# Altium schematic sheet J1.schdoc: TEBF0808 - B2B-connector J1
size A4; DocumentNumber: TEBF0808; Revision: 04; SheetNumber: 3; SheetTotal: 36; Date: 2016-09-29; CompanyName: Trenz Electronic GmbH; Organization: Trenz Electronic GmbH
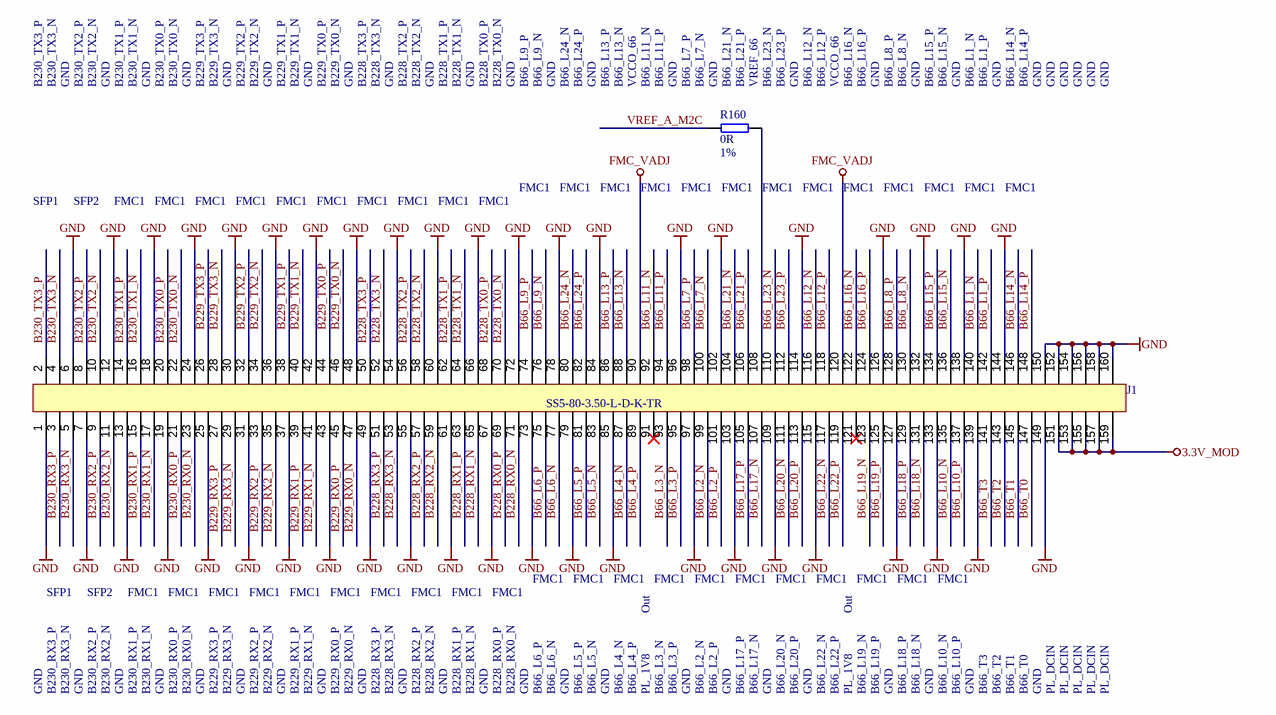
[diagram p0: J1.schdoc]

## Parts
J1  SS5-80-3.50-L-D-K-TR  [SS5-80-3.50-L-D-K-TR]
R160  0R  Tolerance: 1%  [RESC1005X40N]

## Nets
3.3V_MOD: J1.151 J1.153 J1.155 J1.157 J1.159
FMC_VADJ: J1.90 J1.120
GND: J1.1 J1.6 J1.7 J1.12 J1.13 J1.18 J1.19 J1.24 J1.25 J1.30 J1.31 J1.36 J1.37 J1.42 J1.43 J1.48 J1.49 J1.54 J1.55 J1.60 J1.61 J1.66 J1.67 J1.72 J1.73 J1.78 J1.79 J1.84 J1.85 J1.96 J1.97 J1.102 J1.103 J1.109 J1.114 J1.115 J1.126 J1.127 J1.132 J1.133 J1.138 J1.139 J1.144 J1.149 J1.150 J1.152 J1.154 J1.156 J1.158 J1.160
B66_L1_N: J1.140
B66_L1_P: J1.142
B66_L2_N: J1.99
B66_L2_P: J1.101
B66_L3_N: J1.93
B66_L3_P: J1.95
B66_L4_N: J1.87
B66_L4_P: J1.89
B66_L5_N: J1.83
B66_L5_P: J1.81
B66_L6_N: J1.77
B66_L6_P: J1.75
B66_L7_N: J1.100
B66_L7_P: J1.98
B66_L8_N: J1.130
B66_L8_P: J1.128
B66_L9_N: J1.76
B66_L9_P: J1.74
B66_L10_N: J1.135
B66_L10_P: J1.137
B66_L11_N: J1.92
B66_L11_P: J1.94
B66_L12_N: J1.116
B66_L12_P: J1.118
B66_L13_N: J1.88
B66_L13_P: J1.86
B66_L14_N: J1.146
B66_L14_P: J1.148
B66_L15_N: J1.136
B66_L15_P: J1.134
B66_L16_N: J1.122
B66_L16_P: J1.124
B66_L17_N: J1.107
B66_L17_P: J1.105
B66_L18_N: J1.131
B66_L18_P: J1.129
B66_L19_N: J1.123
B66_L19_P: J1.125
B66_L20_N: J1.111
B66_L20_P: J1.113
B66_L21_N: J1.104
B66_L21_P: J1.106
B66_L22_N: J1.117
B66_L22_P: J1.119
B66_L23_N: J1.110
B66_L23_P: J1.112
B66_L24_N: J1.80
B66_L24_P: J1.82
B66_T0: J1.147
B66_T1: J1.145
B66_T2: J1.143
B66_T3: J1.141
B228_RX0_N: J1.71
B228_RX0_P: J1.69
B228_RX1_N: J1.65
B228_RX1_P: J1.63
B228_RX2_N: J1.59
B228_RX2_P: J1.57
B228_RX3_N: J1.53
B228_RX3_P: J1.51
B228_TX0_N: J1.70
B228_TX0_P: J1.68
B228_TX1_N: J1.64
B228_TX1_P: J1.62
B228_TX2_N: J1.58
B228_TX2_P: J1.56
B228_TX3_N: J1.52
B228_TX3_P: J1.50
B229_RX0_N: J1.47
B229_RX0_P: J1.45
B229_RX1_N: J1.41
B229_RX1_P: J1.39
B229_RX2_N: J1.35
B229_RX2_P: J1.33
B229_RX3_N: J1.29
B229_RX3_P: J1.27
B229_TX0_N: J1.46
B229_TX0_P: J1.44
B229_TX1_N: J1.40
B229_TX1_P: J1.38
B229_TX2_N: J1.34
B229_TX2_P: J1.32
B229_TX3_N: J1.28
B229_TX3_P: J1.26
B230_RX0_N: J1.23
B230_RX0_P: J1.21
B230_RX1_N: J1.17
B230_RX1_P: J1.15
B230_RX2_N: J1.11
B230_RX2_P: J1.9
B230_RX3_N: J1.5
B230_RX3_P: J1.3
B230_TX0_N: J1.22
B230_TX0_P: J1.20
B230_TX1_N: J1.16
B230_TX1_P: J1.14
B230_TX2_N: J1.10
B230_TX2_P: J1.8
B230_TX3_N: J1.4
B230_TX3_P: J1.2
VREF_A_M2C: R160.2
NetJ1_108: J1.108 R160.1

Not connected (* = marked no-connect by the designer): J1 91* 121*

## Notes on the sheet
- B230_TX3_P
- B230_TX3_N
- GND
- B230_TX2_P
- B230_TX2_N
- B230_TX1_P
- B230_TX1_N
- B230_TX0_P
- B230_TX0_N
- B229_TX3_P
- B229_TX3_N
- B229_TX2_P
- B229_TX2_N
- B229_TX1_P
- B229_TX1_N
- B229_TX0_P
- B229_TX0_N
- B228_TX3_P
- B228_TX3_N
- B228_TX2_P
- B228_TX2_N
- B228_TX1_P
- B228_TX1_N
- B228_TX0_P
- B228_TX0_N
- B66_L9_P
- B66_L9_N
- B66_L24_N
- B66_L24_P
- B66_L13_P
- B66_L13_N
- VCCO_66
- B66_L11_N
- B66_L11_P
- (near R160) B66_L7_P
- (near R160) B66_L7_N
- (near R160) GND
- (near R160) B66_L21_N
- (near R160) B66_L21_P
- (near R160) VREF_66
- (near R160) B66_L23_N
- (near R160) B66_L23_P
- B66_L12_N
- B66_L12_P
- B66_L16_N
- B66_L16_P
- B66_L8_P
- B66_L8_N
- B66_L15_P
- B66_L15_N
- B66_L1_N
- B66_L1_P
- B66_L14_N
- B66_L14_P
- SFP1
- SFP2
- FMC1
- Out
- B230_RX3_P
- B230_RX3_N
- B230_RX2_P
- B230_RX2_N
- B230_RX1_P
- B230_RX1_N
- B230_RX0_P
- B230_RX0_N
- B229_RX3_P
- B229_RX3_N
- B229_RX2_P
- B229_RX2_N
- B229_RX1_P
- B229_RX1_N
- B229_RX0_P
- B229_RX0_N
- B228_RX3_P
- B228_RX3_N
- B228_RX2_P
- B228_RX2_N
- B228_RX1_P
- B228_RX1_N
- B228_RX0_P
- B228_RX0_N
- B66_L6_P
- B66_L6_N
- B66_L5_P
- B66_L5_N
- B66_L4_N
- B66_L4_P
- PL_1V8
- B66_L3_N
- B66_L3_P
- B66_L2_N
- B66_L2_P
- B66_L17_P
- B66_L17_N
- B66_L20_N
- B66_L20_P
- B66_L22_N
- B66_L22_P
- B66_L19_N
- B66_L19_P
- B66_L18_P
- B66_L18_N
- B66_L10_N
- B66_L10_P
- B66_T3
- B66_T2
- B66_T1
- B66_T0
- PL_DCIN
- Title:
- Number:
- Rev.
- Date:
- A4
- Copyright:
- Page
- of
- Filename:

## Library data of the parts
J1 = 27219: Samtec Ultra Fine Pitch Socket REF192552-01, 160 Pins; AN: 27219; Mixed: SMT; Preferred: Yes; HelpURL: B:\ad\adlib\datasheet\SS5-XX-X.XX-X-D-K-TR; H-ART: REF 192552-01
R160 = 22738: WID SMD 0R; AN: 22738; Mixed: SMT; Value: 0; Preferred: Yes; Case: 1005 (0402); Technology: TK100